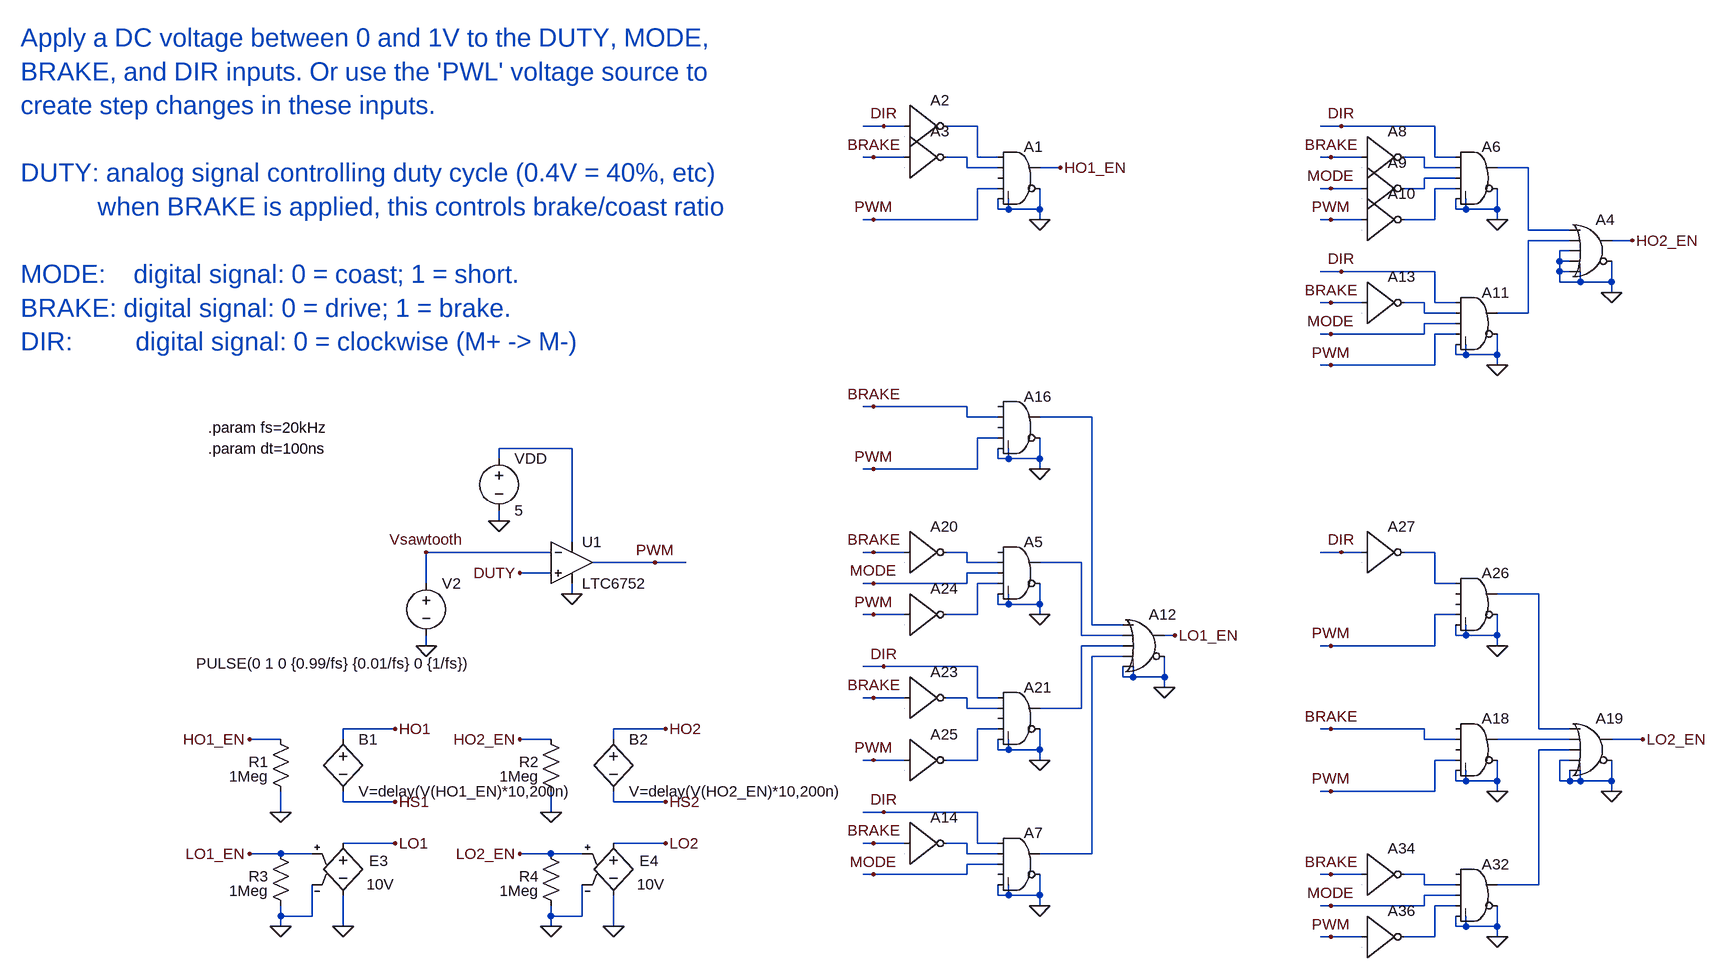
[diagram p0: schematic GateDriver.asc]
GateDriver.asc, the LTspice schematic file:
Version 4
SHEET 1 2020 2124
WIRE 736 -256 704 -256
WIRE 768 -256 736 -256
WIRE 880 -256 832 -256
WIRE 1440 -256 1408 -256
WIRE 1584 -256 1440 -256
WIRE 720 -208 704 -208
WIRE 768 -208 720 -208
WIRE 864 -208 832 -208
WIRE 880 -208 880 -256
WIRE 912 -208 880 -208
WIRE 1424 -208 1408 -208
WIRE 1472 -208 1424 -208
WIRE 1568 -208 1536 -208
WIRE 1584 -208 1584 -256
WIRE 1616 -208 1584 -208
WIRE 864 -192 864 -208
WIRE 912 -192 864 -192
WIRE 1008 -192 976 -192
WIRE 1568 -192 1568 -208
WIRE 1616 -192 1568 -192
WIRE 1728 -192 1680 -192
WIRE 1616 -176 1568 -176
WIRE 912 -160 880 -160
WIRE 1424 -160 1408 -160
WIRE 1472 -160 1424 -160
WIRE 1568 -160 1568 -176
WIRE 1568 -160 1536 -160
WIRE 1616 -160 1584 -160
WIRE 912 -128 912 -144
WIRE 928 -128 928 -144
WIRE 928 -128 912 -128
WIRE 976 -128 976 -160
WIRE 976 -128 928 -128
WIRE 1616 -128 1616 -144
WIRE 1632 -128 1632 -144
WIRE 1632 -128 1616 -128
WIRE 1680 -128 1680 -160
WIRE 1680 -128 1632 -128
WIRE 720 -112 704 -112
WIRE 880 -112 880 -160
WIRE 880 -112 720 -112
WIRE 976 -112 976 -128
WIRE 1424 -112 1408 -112
WIRE 1472 -112 1424 -112
WIRE 1584 -112 1584 -160
WIRE 1584 -112 1536 -112
WIRE 1680 -112 1680 -128
WIRE 1728 -96 1728 -192
WIRE 1792 -96 1728 -96
WIRE 1792 -80 1728 -80
WIRE 1888 -80 1856 -80
WIRE 1792 -64 1776 -64
WIRE 1776 -48 1776 -64
WIRE 1792 -48 1776 -48
WIRE 1440 -32 1408 -32
WIRE 1584 -32 1440 -32
WIRE 1776 -32 1776 -48
WIRE 1792 -32 1776 -32
WIRE 1776 -16 1776 -32
WIRE 1808 -16 1808 -32
WIRE 1808 -16 1776 -16
WIRE 1856 -16 1856 -48
WIRE 1856 -16 1808 -16
WIRE 1856 0 1856 -16
WIRE 1424 16 1408 16
WIRE 1472 16 1424 16
WIRE 1568 16 1536 16
WIRE 1584 16 1584 -32
WIRE 1616 16 1584 16
WIRE 1568 32 1568 16
WIRE 1616 32 1568 32
WIRE 1728 32 1728 -80
WIRE 1728 32 1680 32
WIRE 1616 48 1568 48
WIRE 1424 64 1408 64
WIRE 1568 64 1568 48
WIRE 1568 64 1424 64
WIRE 1616 64 1584 64
WIRE 1616 96 1616 80
WIRE 1632 96 1632 80
WIRE 1632 96 1616 96
WIRE 1680 96 1680 64
WIRE 1680 96 1632 96
WIRE 1424 112 1408 112
WIRE 1584 112 1584 64
WIRE 1584 112 1424 112
WIRE 1680 112 1680 96
WIRE 720 176 704 176
WIRE 864 176 720 176
WIRE 864 192 864 176
WIRE 912 192 864 192
WIRE 1056 192 976 192
WIRE 912 224 880 224
WIRE 256 240 144 240
WIRE 144 256 144 240
WIRE 912 256 912 240
WIRE 928 256 928 240
WIRE 928 256 912 256
WIRE 976 256 976 224
WIRE 976 256 928 256
WIRE 720 272 704 272
WIRE 880 272 880 224
WIRE 880 272 720 272
WIRE 976 272 976 256
WIRE 144 352 144 336
WIRE 256 384 256 240
WIRE 224 400 32 400
WIRE 720 400 704 400
WIRE 768 400 720 400
WIRE 864 400 832 400
WIRE 1440 400 1408 400
WIRE 1472 400 1440 400
WIRE 1584 400 1536 400
WIRE 384 416 288 416
WIRE 432 416 384 416
WIRE 864 416 864 400
WIRE 912 416 864 416
WIRE 1040 416 976 416
WIRE 224 432 176 432
WIRE 912 432 864 432
WIRE 32 448 32 400
WIRE 720 448 704 448
WIRE 864 448 864 432
WIRE 864 448 720 448
WIRE 912 448 880 448
WIRE 1584 448 1584 400
WIRE 1616 448 1584 448
WIRE 256 464 256 448
WIRE 1744 464 1680 464
WIRE 912 480 912 464
WIRE 928 480 928 464
WIRE 928 480 912 480
WIRE 976 480 976 448
WIRE 976 480 928 480
WIRE 720 496 704 496
WIRE 768 496 720 496
WIRE 880 496 880 448
WIRE 880 496 832 496
WIRE 976 496 976 480
WIRE 1616 496 1584 496
WIRE 1056 512 1056 192
WIRE 1104 512 1056 512
WIRE 1040 528 1040 416
WIRE 1104 528 1040 528
WIRE 1184 528 1168 528
WIRE 1616 528 1616 512
WIRE 1632 528 1632 512
WIRE 1632 528 1616 528
WIRE 1680 528 1680 496
WIRE 1680 528 1632 528
WIRE 32 544 32 528
WIRE 1104 544 1040 544
WIRE 1424 544 1408 544
WIRE 1584 544 1584 496
WIRE 1584 544 1424 544
WIRE 1680 544 1680 528
WIRE 1104 560 1056 560
WIRE 736 576 704 576
WIRE 880 576 736 576
WIRE 1104 592 1104 576
WIRE 1120 592 1120 576
WIRE 1120 592 1104 592
WIRE 1168 592 1168 560
WIRE 1168 592 1120 592
WIRE 1168 608 1168 592
WIRE 720 624 704 624
WIRE 768 624 720 624
WIRE 864 624 832 624
WIRE 880 624 880 576
WIRE 912 624 880 624
WIRE 864 640 864 624
WIRE 912 640 864 640
WIRE 1040 640 1040 544
WIRE 1040 640 976 640
WIRE -16 672 -96 672
WIRE 400 672 320 672
WIRE 912 672 880 672
WIRE 1424 672 1408 672
WIRE 1568 672 1424 672
WIRE 1744 672 1744 464
WIRE 1792 672 1744 672
WIRE -192 688 -240 688
WIRE -96 688 -96 672
WIRE 224 688 176 688
WIRE 320 688 320 672
WIRE 1568 688 1568 672
WIRE 1616 688 1568 688
WIRE 1792 688 1680 688
WIRE 1904 688 1856 688
WIRE 912 704 912 688
WIRE 928 704 928 688
WIRE 928 704 912 704
WIRE 976 704 976 672
WIRE 976 704 928 704
WIRE 1792 704 1744 704
WIRE 720 720 704 720
WIRE 768 720 720 720
WIRE 880 720 880 672
WIRE 880 720 832 720
WIRE 976 720 976 704
WIRE 1616 720 1584 720
WIRE 1792 720 1776 720
WIRE 1616 752 1616 736
WIRE 1632 752 1632 736
WIRE 1632 752 1616 752
WIRE 1680 752 1680 720
WIRE 1680 752 1632 752
WIRE 1776 752 1776 720
WIRE 1792 752 1792 736
WIRE 1792 752 1776 752
WIRE 1808 752 1808 736
WIRE 1808 752 1792 752
WIRE 1856 752 1856 720
WIRE 1856 752 1808 752
WIRE 1424 768 1408 768
WIRE 1584 768 1584 720
WIRE 1584 768 1424 768
WIRE 1680 768 1680 752
WIRE 1856 768 1856 752
WIRE -96 784 -96 768
WIRE -16 784 -96 784
WIRE 320 784 320 768
WIRE 400 784 320 784
WIRE -192 800 -192 768
WIRE 224 800 224 768
WIRE 736 800 704 800
WIRE 880 800 736 800
WIRE -16 848 -96 848
WIRE 400 848 320 848
WIRE 720 848 704 848
WIRE 768 848 720 848
WIRE 864 848 832 848
WIRE 880 848 880 800
WIRE 912 848 880 848
WIRE -192 864 -240 864
WIRE -144 864 -192 864
WIRE 224 864 176 864
WIRE 272 864 224 864
WIRE 864 864 864 848
WIRE 912 864 864 864
WIRE 1056 864 1056 560
WIRE 1056 864 976 864
WIRE 912 880 864 880
WIRE 720 896 704 896
WIRE 864 896 864 880
WIRE 864 896 720 896
WIRE 1424 896 1408 896
WIRE 1472 896 1424 896
WIRE 1568 896 1536 896
WIRE 1568 912 1568 896
WIRE 1616 912 1568 912
WIRE 1744 912 1744 704
WIRE 1744 912 1680 912
WIRE 912 928 912 912
WIRE 928 928 928 912
WIRE 928 928 912 928
WIRE 976 928 976 896
WIRE 976 928 928 928
WIRE 1616 928 1568 928
WIRE 976 944 976 928
WIRE 1424 944 1408 944
WIRE 1568 944 1568 928
WIRE 1568 944 1424 944
WIRE 1616 944 1584 944
WIRE -192 960 -192 944
WIRE -144 960 -144 912
WIRE -144 960 -192 960
WIRE 224 960 224 944
WIRE 272 960 272 912
WIRE 272 960 224 960
WIRE -192 976 -192 960
WIRE -96 976 -96 928
WIRE 224 976 224 960
WIRE 320 976 320 928
WIRE 1616 976 1616 960
WIRE 1632 976 1632 960
WIRE 1632 976 1616 976
WIRE 1680 976 1680 944
WIRE 1680 976 1632 976
WIRE 1424 992 1408 992
WIRE 1472 992 1424 992
WIRE 1584 992 1584 944
WIRE 1584 992 1536 992
WIRE 1680 992 1680 976
FLAG 144 352 0
FLAG 256 464 0
FLAG 32 544 0
FLAG 384 416 PWM
FLAG 736 -256 DIR
FLAG 720 -208 BRAKE
FLAG 720 -112 PWM
FLAG 1440 -256 DIR
FLAG 1424 -208 BRAKE
FLAG 1424 -160 MODE
FLAG 1424 -112 PWM
FLAG 1440 -32 DIR
FLAG 1424 16 BRAKE
FLAG 1424 64 MODE
FLAG 1424 112 PWM
FLAG 720 176 BRAKE
FLAG 720 272 PWM
FLAG 720 448 MODE
FLAG 720 496 PWM
FLAG 736 576 DIR
FLAG 720 624 BRAKE
FLAG 720 720 PWM
FLAG 1440 400 DIR
FLAG 1424 544 PWM
FLAG 736 800 DIR
FLAG 720 848 BRAKE
FLAG 720 896 MODE
FLAG 1424 672 BRAKE
FLAG 1424 768 PWM
FLAG 1424 896 BRAKE
FLAG 1424 944 MODE
FLAG 1424 992 PWM
FLAG 1904 688 LO2_EN
FLAG 1184 528 LO1_EN
FLAG 1008 -192 HO1_EN
FLAG 1888 -80 HO2_EN
FLAG -240 688 HO1_EN
FLAG 976 272 0
FLAG 976 496 0
FLAG 976 720 0
FLAG 976 944 0
FLAG 1680 992 0
FLAG 1680 768 0
FLAG 1680 544 0
FLAG 1680 112 0
FLAG 1680 -112 0
FLAG 1168 608 0
FLAG -192 800 0
FLAG 976 -112 0
FLAG 1856 0 0
FLAG -16 784 HS1
FLAG -16 672 HO1
FLAG 176 688 HO2_EN
FLAG 224 800 0
FLAG 400 784 HS2
FLAG 400 672 HO2
FLAG -240 864 LO1_EN
FLAG -192 976 0
FLAG -16 848 LO1
FLAG 176 864 LO2_EN
FLAG 224 976 0
FLAG 400 848 LO2
FLAG -96 976 0
FLAG 320 976 0
FLAG 176 432 DUTY
FLAG 32 400 Vsawtooth
FLAG 1856 768 0
FLAG 720 400 BRAKE
SYMBOL Comparators\\LTC6752 256 352 R0
SYMATTR InstName U1
SYMBOL voltage 144 240 R0
WINDOW 123 0 0 Left 2
WINDOW 39 0 0 Left 2
SYMATTR InstName VDD
SYMATTR Value 5
SYMBOL voltage 32 432 R0
WINDOW 3 -354 139 Left 2
WINDOW 123 0 0 Left 2
WINDOW 39 0 0 Left 2
SYMATTR Value PULSE(0 1 0 {0.99/fs} {0.01/fs} 0 {1/fs})
SYMATTR InstName V2
SYMBOL Digital\\inv 768 -320 R0
SYMATTR InstName A2
SYMBOL Digital\\inv 768 -272 R0
SYMATTR InstName A3
SYMBOL Digital\\and 1648 -240 R0
SYMATTR InstName A6
SYMBOL Digital\\inv 1472 -272 R0
SYMATTR InstName A8
SYMBOL Digital\\inv 1472 -224 R0
SYMATTR InstName A9
SYMBOL Digital\\inv 1472 -176 R0
SYMATTR InstName A10
SYMBOL Digital\\and 1648 -16 R0
SYMATTR InstName A11
SYMBOL Digital\\inv 1472 -48 R0
SYMATTR InstName A13
SYMBOL Digital\\and 944 144 R0
SYMATTR InstName A16
SYMBOL Digital\\or 1824 -128 R0
SYMATTR InstName A4
SYMBOL Digital\\and 944 368 R0
SYMATTR InstName A5
SYMBOL Digital\\and 944 592 R0
SYMATTR InstName A21
SYMBOL Digital\\inv 768 560 R0
SYMATTR InstName A23
SYMBOL Digital\\inv 768 656 R0
SYMATTR InstName A25
SYMBOL Digital\\and 1648 416 R0
SYMATTR InstName A26
SYMBOL Digital\\inv 1472 336 R0
SYMATTR InstName A27
SYMBOL Digital\\and 944 816 R0
SYMATTR InstName A7
SYMBOL Digital\\inv 768 784 R0
SYMATTR InstName A14
SYMBOL Digital\\or 1136 480 R0
SYMATTR InstName A12
SYMBOL Digital\\and 1648 640 R0
SYMATTR InstName A18
SYMBOL Digital\\and 1648 864 R0
SYMATTR InstName A32
SYMBOL Digital\\inv 1472 832 R0
SYMATTR InstName A34
SYMBOL Digital\\inv 1472 928 R0
SYMATTR InstName A36
SYMBOL res -208 672 R0
WINDOW 0 -33 51 Left 2
WINDOW 3 -63 73 Left 2
SYMATTR InstName R1
SYMATTR Value 1Meg
SYMBOL Digital\\and 944 -240 R0
SYMATTR InstName A1
SYMBOL res 208 672 R0
WINDOW 0 -33 51 Left 2
WINDOW 3 -63 73 Left 2
SYMATTR InstName R2
SYMATTR Value 1Meg
SYMBOL res -208 848 R0
WINDOW 0 -33 51 Left 2
WINDOW 3 -63 73 Left 2
SYMATTR InstName R3
SYMATTR Value 1Meg
SYMBOL e -96 832 R0
WINDOW 0 40 43 Left 2
WINDOW 3 36 79 Left 2
SYMATTR InstName E3
SYMATTR Value 10V
SYMBOL res 208 848 R0
WINDOW 0 -33 51 Left 2
WINDOW 3 -63 73 Left 2
SYMATTR InstName R4
SYMATTR Value 1Meg
SYMBOL e 320 832 R0
WINDOW 0 40 43 Left 2
WINDOW 3 36 79 Left 2
SYMATTR InstName E4
SYMATTR Value 10V
SYMBOL Digital\\or 1824 640 R0
SYMATTR InstName A19
SYMBOL Digital\\inv 768 336 R0
SYMATTR InstName A20
SYMBOL Digital\\inv 768 432 R0
SYMATTR InstName A24
SYMBOL bv -96 672 R0
SYMATTR InstName B1
SYMATTR Value V=delay(V(HO1_EN)*10,200n)
SYMBOL bv 320 672 R0
SYMATTR InstName B2
SYMATTR Value V=delay(V(HO2_EN)*10,200n)
TEXT -304 208 Left 2 !.param fs=20kHz
TEXT -592 -392 Left 4 ;Apply a DC voltage between 0 and 1V to the DUTY, MODE,  \nBRAKE, and DIR inputs. Or use the 'PWL' voltage source to  \ncreate step changes in these inputs.\n \nDUTY: analog signal controlling duty cycle (0.4V = 40%, etc) \n           when BRAKE is applied, this controls brake/coast ratio \n \nMODE:    digital signal: 0 = coast; 1 = short.\nBRAKE: digital signal: 0 = drive; 1 = brake. \nDIR:         digital signal: 0 = clockwise (M+ -> M-)
TEXT -304 240 Left 2 !.param dt=100ns

The netlist it stands for:
* GateDriver.asc
XU1 DUTY Vsawtooth N010 0 PWM LTC6752  ; pins In+ In- V+ V- OUT
VDD N010 0 5
V2 Vsawtooth 0 PULSE(0 1 0 {0.99/fs} {0.01/fs} 0 {1/fs})
A2 DIR 0 0 0 0 N001 0 0 BUF
A3 BRAKE 0 0 0 0 N002 0 0 BUF
A6 DIR N003 N005 N006 0 0 N004 0 AND
A8 BRAKE 0 0 0 0 N003 0 0 BUF
A9 MODE 0 0 0 0 N005 0 0 BUF
A10 PWM 0 0 0 0 N006 0 0 BUF
A11 DIR N008 MODE PWM 0 0 N007 0 AND
A13 BRAKE 0 0 0 0 N008 0 0 BUF
A16 0 BRAKE 0 PWM 0 0 N009 0 AND
A4 N004 N007 0 0 0 0 HO2_EN 0 OR
A5 0 N011 MODE N014 0 0 N013 0 AND
A21 DIR N018 0 N019 0 0 N016 0 AND
A23 BRAKE 0 0 0 0 N018 0 0 BUF
A25 PWM 0 0 0 0 N019 0 0 BUF
A26 N012 0 0 PWM 0 0 N015 0 AND
A27 DIR 0 0 0 0 N012 0 0 BUF
A7 DIR N022 MODE 0 0 0 N017 0 AND
A14 BRAKE 0 0 0 0 N022 0 0 BUF
A12 N009 N013 N016 N017 0 0 LO1_EN 0 OR
A18 0 BRAKE 0 PWM 0 0 N020 0 AND
A32 0 N023 MODE N024 0 0 N021 0 AND
A34 BRAKE 0 0 0 0 N023 0 0 BUF
A36 PWM 0 0 0 0 N024 0 0 BUF
R1 HO1_EN 0 1Meg
A1 N001 N002 0 PWM 0 0 HO1_EN 0 AND
R2 HO2_EN 0 1Meg
R3 LO1_EN 0 1Meg
E3 LO1 0 LO1_EN 0 10V
R4 LO2_EN 0 1Meg
E4 LO2 0 LO2_EN 0 10V
A19 N015 N020 N021 0 0 0 LO2_EN 0 OR
A20 BRAKE 0 0 0 0 N011 0 0 BUF
A24 PWM 0 0 0 0 N014 0 0 BUF
B1 HO1 HS1 V=delay(V(HO1_EN)*10,200n)
B2 HO2 HS2 V=delay(V(HO2_EN)*10,200n)
.param fs=20kHz
* Apply a DC voltage between 0 and 1V to the DUTY, MODE,
* BRAKE, and DIR inputs. Or use the 'PWL' voltage source to
* create step changes in these inputs.
* DUTY: analog signal controlling duty cycle (0.4V = 40%, etc)
*            when BRAKE is applied, this controls brake/coast ratio
* MODE:    digital signal: 0 = coast; 1 = short.
* BRAKE: digital signal: 0 = drive; 1 = brake.
* DIR:         digital signal: 0 = clockwise (M+ -> M-)
.param dt=100ns
.lib LTC7.lib
.backanno
.end